# Altium project Shield_MCXC444.PrjPcb
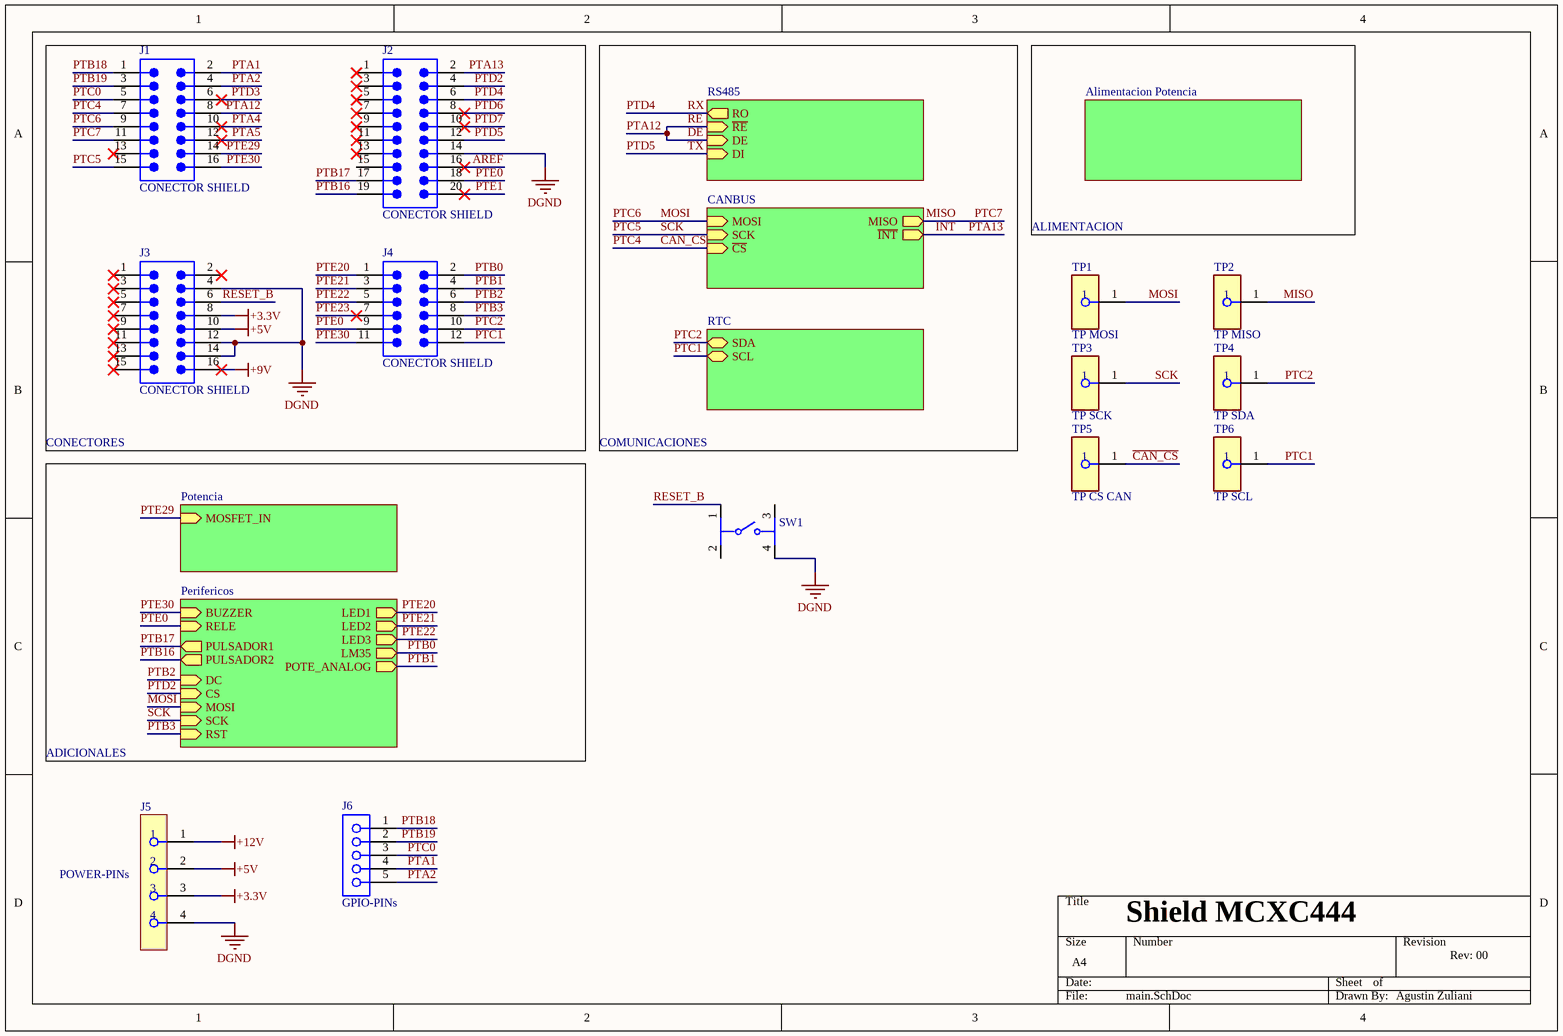
[diagram p0: main.SchDoc]
Libreria-Altium: D:\Altium-Libraries-master\Altium-Libraries-master
6 sheets, 99 parts. Net scope: hierarchical (ports join the sheet entries above them; power ports are global).
Board file: Shield_MCXC444 - PCB.PcbDoc
Sheets:
  main.SchDoc
    RS485 = RS485.SchDoc
    CANBUS = CANBUS.SchDoc
    Potencia = Potencia.SchDoc
    Perifericos = Perifericos.SchDoc
    RTC = RTC.SchDoc

## Sheet main.SchDoc: Shield MCXC444
size A4; Author: Agustin Zuliani; CompanyName: Depto. de Sistemas e Informática (DSI); DrawnBy: Agustin Zuliani; Revision: Rev: 00; SheetNumber: 1; SheetTotal: 7

### Parts
J1  CONECTOR SHIELD  [61301621121]
J2  CONECTOR SHIELD  [61302021121]
J3  CONECTOR SHIELD  [61301621121]
J4  CONECTOR SHIELD  [61301221121]
J5  POWER-PINs  [FP-ESW-104-23-G-S-MFG]
J6  GPIO-PINs  [SMTC-SMH-105-02-X-S]
SW1  PULSADOR RESET  [FP-1-1825910-4-MFG]  (value not drawn)
TP1  TP MOSI  [FP-5004-MFG]
TP2  TP MISO  [FP-5004-MFG]
TP3  TP SCK  [FP-5004-MFG]
TP4  TP SDA  [FP-5004-MFG]
TP5  TP CS CAN  [FP-5004-MFG]
TP6  TP SCL  [FP-5004-MFG]

### Blocks framed on the sheet
CONECTORES: J1-J4

### Sub-sheets
Alimentacion Potencia = Alimentacion Potencia.SchDoc (file not in this document): no entries
CANBUS = CANBUS.SchDoc: MOSI (in), MISO (out), SCK (in), ~{CS} (in), ~{INT} (out)
Perifericos = Perifericos.SchDoc: LED1 (out), LED2 (out), LED3 (out), BUZZER (in), RELE (in), PULSADOR1 (out), PULSADOR2 (out), LM35 (out), POTE_ANALOG (out), DC (in), CS (in), MOSI (in), SCK (in), RST (in)
Potencia = Potencia.SchDoc: MOSFET_IN (in)
RS485 = RS485.SchDoc: ~{RE} (in), DE (in), DI (in), RO (out)
RTC = RTC.SchDoc: SDA (bidir), SCL (bidir)

### Nets
+3.3V: J3.8 J5.3
+5V: J3.10 J5.2
+9V: J3.16
+12V: J5.1
DGND: J2.14 J3.4 J3.12 J3.14 J5.4 SW1.4
~{CAN_CS}: J1.7 TP5.1 ; sheet CANBUS/~{CS}  [also labelled PTC4]
~{INT}: J2.2 ; sheet CANBUS/~{INT}  [also labelled PTA13]
~{RE}: J1.8 ; sheet RS485/~{RE}, sheet RS485/DE  [also labelled DE, PTA12]
AREF: J2.16
MISO: J1.11 TP2.1 ; sheet CANBUS/MISO  [also labelled PTC7]
MOSI: J1.9 TP1.1 ; sheet CANBUS/MOSI, sheet Perifericos/MOSI  [also labelled PTC6]
PTA1: J1.2 J6.4
PTA2: J1.4 J6.5
PTA4: J1.10
PTA5: J1.12
PTB0: J4.2 ; sheet Perifericos/LM35
PTB1: J4.4 ; sheet Perifericos/POTE_ANALOG
PTB2: J4.6 ; sheet Perifericos/DC
PTB3: J4.8 ; sheet Perifericos/RST
PTB16: J2.19 ; sheet Perifericos/PULSADOR2
PTB17: J2.17 ; sheet Perifericos/PULSADOR1
PTB18: J1.1 J6.1
PTB19: J1.3 J6.2
PTC0: J1.5 J6.3
PTC1: J4.12 TP6.1 ; sheet RTC/SCL
PTC2: J4.10 TP4.1 ; sheet RTC/SDA
PTC5: J1.15 TP3.1 ; sheet CANBUS/SCK, sheet Perifericos/SCK  [also labelled SCK]
PTD2: J2.4 ; sheet Perifericos/CS
PTD3: J1.6
PTD4: J2.6 ; sheet RS485/RO  [also labelled RX]
PTD5: J2.12 ; sheet RS485/DI  [also labelled TX]
PTD6: J2.8
PTD7: J2.10
PTE0: J2.18 J4.9 ; sheet Perifericos/RELE
PTE1: J2.20
PTE20: J4.1 ; sheet Perifericos/LED1
PTE21: J4.3 ; sheet Perifericos/LED2
PTE22: J4.5 ; sheet Perifericos/LED3
PTE23: J4.7
PTE29: J1.14 ; sheet Potencia/MOSFET_IN
PTE30: J1.16 J4.11 ; sheet Perifericos/BUZZER
RESET_B: J3.6 SW1.1

Not connected (* = marked no-connect by the designer): J1 13*; J2 1* 3* 5* 7* 9* 11* 13* 15; J3 1* 2* 3* 5* 7* 9* 11* 13* 15*; SW1 2 3

### Notes on the sheet
- ALIMENTACION
- COMUNICACIONES
- ADICIONALES

### Library data of the parts
J1 J3 = CMP-1502-01097-3: HEADER PINS 16 POS 2.54mm / Conexion shield; NexarPartId: 32855550; Contact Resistance: 20mΩ; Operating Supply Voltage: 250V; Number of Contacts: 16; Current Rating: 3A; Connector Type: Male Pin; Gender: Male; Min Operating Temperature: -40°C; Contact Material: Copper; RoHS: Compliant; Lead Pitch: 2.54mm; Color: Black; Contact Mating Length: 5.9944mm; REACH SVHC: Unknown; Number of Rows: 2; Orientation: Vertical; Number of Positions: 16; Max Operating Temperature: 105°C; Termination: Solder; Packaging: Bulk; Height: 8.89mm; Mount: Through Hole; Contact Plating: Gold; Row Spacing: 2.54mm; Voltage Rating: 250V; Number of Pins: 16; Pitch: 2.54mm
J2 = CMP-1502-01104-3: HEADER PINS 20 POS 2.54mm / Conexion shield; NexarPartId: 32855556; Current Rating: 3A; Operating Supply Voltage: 250V; Contact Resistance: 20mΩ; Gender: Male; Number of Positions: 20; Connector Type: Male Pin; Contact Material: Copper; Number of Rows: 2; Lead Pitch: 2.54mm; Packaging: Bulk; Mount: Through Hole; Number of Pins: 20; Row Spacing: 2.54mm; Contact Mating Length: 5.9944mm; Number of Contacts: 20; Pitch: 2.54mm; Color: Black; Contact Plating: Gold; Orientation: Vertical; Termination: Solder; REACH SVHC: Unknown; RoHS: Compliant
J4 = CMP-1502-01088-4: HEADER PINS 12 POS 2.54mm / Conexion shield; NexarPartId: 32855540; Gender: Male; Number of Contacts: 12; Contact Resistance: 20mΩ; Connector Type: Male Pin; Current Rating: 3A; Operating Supply Voltage: 250V; Termination: Solder; Contact Plating: Gold; Height: 8.89mm; Color: Black; Row Spacing: 2.54mm; Contact Mating Length: 5.9944mm; REACH SVHC: Unknown; Mount: Through Hole; Orientation: Vertical; Number of Rows: 2; Packaging: Bulk; Number of Pins: 12; Number of Positions: 12; Contact Material: Copper; Lead Pitch: 2.54mm; Min Operating Temperature: -40°C; Voltage Rating: 250V; RoHS: Compliant; Pitch: 2.54mm; Max Operating Temperature: 105°C
J5 = CMP-00575-09268283-1: HEADER PINS 4 POS 2.54mm / Power Pins; Manufacturer Lifecycle Status: PRODUCTION; Contact Resistance: 10mΩ; Max Voltage Rating (AC): 550V; Current Rating: 5.2A; Max Current Rating: 6.9A; Number of Contacts: 4; Length: 10.67mm; Termination: Solder; Contact Material: Gold, Nickel; Orientation: Straight; Housing Material: Polyester; Max Operating Temperature: 125°C; Depth: 2.41mm; RoHS: Compliant; Housing Color: Black; Min Operating Temperature: -55°C; Number of Rows: 1; Height: 13.72mm; Radiation Hardening: No; Lifecycle Status: Production; Pitch: 2.54mm; Contact Plating: Gold
J6 = CMP-1023-00168-1: HEADER PINS 5 POS / Gpios Pins; PartNumber: SMH-105-02-G-S; Manufacturer: Samtec; Pitch: 2.54 mm; ComponentLink2Description: Datasheet; RoHS: True; ComponentLink2URL: http://www.samtec.com/documents/webfiles/pdf/SMH.PDF; ComponentLink1URL: http://www.samtec.com; DatasheetVersion: F-214; PackageReference: SMH-105-02-X-S; ComponentLink3URL: http://www.samtec.com/documents/webfiles/cpdf/SMH-1XX-XX-XX-X-XX-MKT.pdf; PackageDescription: .100 [2.54] Horizontal SMT Socket Assembly; Mounting Technology: Surface Mount; PackageVersion: AF, 2/1999; ComponentLink3Description: Package Specification; Temperature Range: -55 to 125 degC; Orientation: Horizontal; ComponentLink1Description: Manufacturer URL
SW1 = CMP-03407-000002-1: SWITCH TACTILE 6mm / RESET; Manufacturer: TE Connectivity; Manufacturer Part Number: 1-1825910-4; Throw Configuration: SPST-NO; Operating Force: 160gf; Contact Current Rating: 50mA; Voltage Rating Dc: 24V; Electromechanical Life: 100000Cycles; Contact Resistance: 100mΩ; Octopart: https://octopart.com/1-1825910-4-te+connectivity-42270468; ComponentLink2URL: https://www.te.com/commerce/DocumentDelivery/DDEController?Action=showdoc&DocId=Customer+Drawing%7F1825910%7FC10%7Fpdf%7FEnglish%7FENG_CD_1825910_C10.pdf%7F1-1825910-4; Height: 9.8mm; Package: 1-1825910-4; Automotive: No; Device Class L2: Switches; Temperature Range High: +85°C; Device Class L3: Tactile Switches; Mouser Description: Tactile Switches 6MM ACTHIGH TEMP TACT SWITCH; Lead Free: Yes; Temperature Range Low: -35°C; Digikey Description: SWITCH TACTILE SPST-NO 0.05A 24V; Device Class L1: Electromechanical; Mount: Through Hole; RoHS: TRUE; ComponentLink2Description: Datasheet; Temperature: -35°C to +85°C; Category: Switch
TP1-TP6 = CMP-2000-05575-2: PC TEST POINT MINIATURE YELLOW; Manufacturer: Keystone; Manufacturer Part Number: 5004; Number Of Contacts: 1; Is Female: yes; Device Class L1: Connectors; Digikey Description: PC TEST POINT MINIATURE YELLOW; ComponentLink2URL: https://www.keyelco.com/product-pdf.cfm?p=1313; Lead Free: Yes; ComponentLink2Description: Datasheet; Category: Conn; Height: 4.72mm; Octopart: https://octopart.com/5004-keystone-28591; Mouser Description: TEST POINT PC MINI .040"D YELLOW; Device Class L3: unset; Contact Material: Silver; Package: 5004; Automotive: No; Device Class L2: unset; RoHS: TRUE

## Sheet RS485.SchDoc: Comunicación RS-485
size A4; Author: Agustin Zuliani; Revision: Rev: 00; SheetNumber: 2; SheetTotal: 7
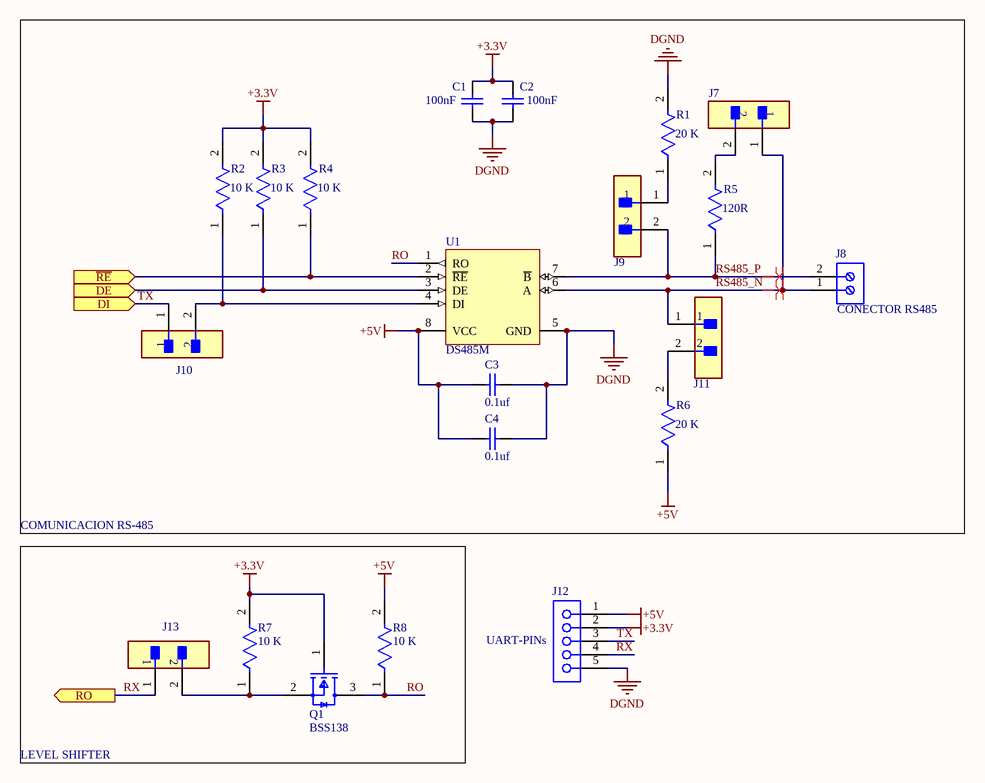
[diagram p1: RS485.SchDoc]

### Parts
C1  100nF  [CAPC2013X145X50LL20T25]
C2  100nF  [CAPC2013X145X50LL20T25]
C3  0.1uf  [CAPC2013X145X50NL20T25]
C4  0.1uf  [CAPC2013X145X50NL20T25]
J7  TSW-102-07-F-S  [FP-TSW-102-07-F-S-MFG]  (value not drawn)
J8  CONECTOR RS485  [691102710002]
J9  TSW-102-07-F-S  [FP-TSW-102-07-F-S-MFG]  (value not drawn)
J10  TSW-102-07-F-S  [FP-TSW-102-07-F-S-MFG]  (value not drawn)
J11  TSW-102-07-F-S  [FP-TSW-102-07-F-S-MFG]  (value not drawn)
J12  UART-PINs  [SMTC-ESQ-105-12-X-S]
J13  TSW-102-07-F-S  [FP-TSW-102-07-F-S-MFG]  (value not drawn)
Q1  BSS138  [FP-318-08-IPC_B]
R1  20 K  [FP-RN73R2A-IPC_A]
R2  10 K  [FP-RN73R2A-IPC_A]
R3  10 K  [FP-RN73R2A-IPC_A]
R4  10 K  [FP-RN73R2A-IPC_A]
R5  120R  [FP-RN73R2A-IPC_A]
R6  20 K  [FP-RN73R2A-IPC_A]
R7  10 K  [FP-AC0805-MFG]
R8  10 K  [FP-AC0805-MFG]
U1  DS485M  [D0008A_N]

### Blocks framed on the sheet
COMUNICACION RS-485: C1-C4 J7-J11 R1-R6 U1

### Ports
DE (in), DI (in), RO (out), ~{RE} (in)

### Nets
+3.3V: C1.1 C2.1 J12.2 Q1.1(G) R2.2 R3.2 R4.2 R7.2
+5V: C3.2 C4.2 J12.1 R6.1 R8.2 U1.8(VCC)
DGND: C1.2 C2.2 C3.1 C4.1 J12.5 R1.2 U1.5(GND)
~{RE}: R3.1 R4.1 U1.2(~{RE}) U1.3(DE) ; port ~{RE}, port DE
RO: Q1.3(D) R8.1 U1.1(RO)
RS485_N: J7.1 J8.1 J11.1 U1.6(A)
RS485_P: J8.2 J9.2 R5.1 U1.7(~{B})
RX: J12.4 J13.1 ; port RO  [project net PTD4]
TX: J10.1 J12.3 ; port DI  [project net PTD5]
NetJ7_2: J7.2 R5.2
NetJ9_1: J9.1 R1.1
NetJ10_2: J10.2 R2.1 U1.4(DI)
NetJ11_2: J11.2 R6.2
NetJ13_2: J13.2 Q1.2(S) R7.1

### Layout directives
differential pair: RS485_N, RS485_P

### Notes on the sheet
- LEVEL SHIFTER

### Library data of the parts
C1 C2 = CMP-2007-01107-1: CAP 100nf 20% 0805; Manufacturer: Kemet; Part Number: C0805X104K3RACTU
C3 C4 = CMP-2007-01227-1: CAP 100nf 20% 0805; Manufacturer: Kemet; Part Number: C0805S104K5RACTU
J7 = CMP-02766-001458-1: HEADER 2 POS 2.54mm; Gender: Male; Max Current Rating: 7.6A; Number of Contacts: 2; Max Voltage Rating (AC): 550V; Orientation: Straight; Depth: 2.54mm; Series: TSW; Package Quantity: 1; Min Operating Temperature: -55°C; Max Operating Temperature: 125°C; Contact Type: Male Pin; Contact Shape: Square; Color: Black; Housing Color: Black; Connector Type: Header; Fastening Type: Pull; Radiation Hardening: No; Pitch: 2.54mm; Housing Material: Polyester; Mount: Through Hole; Number of Positions: 2; Number of Rows: 1; Contact Material: Bronze; Insulation Color: Black; Contact Finish - Mating: GOLD; Termination: Solder; Insulation Material: PBT; Length: 5.08mm; Flammability Rating: UL94 V-0; Contact Mating Length: 0.23inch; REACH SVHC: No SVHC; Contact Plating: Gold; RoHS Compliant: Yes; Packaging: Bulk
J8 = CMP-1502-03258-2: NexarPartId: 8917706; Number of Levels: 1; Number of Positions Per Level: 2; Current: 15A; Voltage: 300V; Pitch: 5.0038mm; Plating: Steel; Stripping Length: -6mm; Wire Gauge (Min): 14AWG; Wire Gauge (Max): 22AWG; Length: 7.5mm; Contact Material: Brass; Contact Plating: Tin; Packaging: Box; Number of Pins: 2; Voltage Rating: 300V; Termination: Screw; Number of Contacts: 2; Color: Blue; Current Rating: 15A; Mount: Through Hole; Max Operating Temperature: 105°C; Min Operating Temperature: -40°C; REACH SVHC: Unknown; Height: 13.4mm; Width: 11.2mm; Housing Material: Nylon; RoHS: Compliant; Wire/Cable Gauge: 22AWG; Lead Pitch: 5mm
J9 J11 = CMP-02766-001458-1: HEADER 2 POS 2.54mm / Habilitacion RES 20K; Gender: Male; Max Current Rating: 7.6A; Number of Contacts: 2; Max Voltage Rating (AC): 550V; Orientation: Straight; Depth: 2.54mm; Series: TSW; Package Quantity: 1; Min Operating Temperature: -55°C; Max Operating Temperature: 125°C; Contact Type: Male Pin; Contact Shape: Square; Color: Black; Housing Color: Black; Connector Type: Header; Fastening Type: Pull; Radiation Hardening: No; Pitch: 2.54mm; Housing Material: Polyester; Mount: Through Hole; Number of Positions: 2; Number of Rows: 1; Contact Material: Bronze; Insulation Color: Black; Contact Finish - Mating: GOLD; Termination: Solder; Insulation Material: PBT; Length: 5.08mm; Flammability Rating: UL94 V-0; Contact Mating Length: 0.23inch; REACH SVHC: No SVHC; Contact Plating: Gold; RoHS Compliant: Yes; Packaging: Bulk
J10 = CMP-02766-001458-1: HEADER 2 POS 2.54mm / Habilitacion TX; Gender: Male; Max Current Rating: 7.6A; Number of Contacts: 2; Max Voltage Rating (AC): 550V; Orientation: Straight; Depth: 2.54mm; Series: TSW; Package Quantity: 1; Min Operating Temperature: -55°C; Max Operating Temperature: 125°C; Contact Type: Male Pin; Contact Shape: Square; Color: Black; Housing Color: Black; Connector Type: Header; Fastening Type: Pull; Radiation Hardening: No; Pitch: 2.54mm; Housing Material: Polyester; Mount: Through Hole; Number of Positions: 2; Number of Rows: 1; Contact Material: Bronze; Insulation Color: Black; Contact Finish - Mating: GOLD; Termination: Solder; Insulation Material: PBT; Length: 5.08mm; Flammability Rating: UL94 V-0; Contact Mating Length: 0.23inch; REACH SVHC: No SVHC; Contact Plating: Gold; RoHS Compliant: Yes; Packaging: Bulk
J12 = CMP-1026-00012-1: HEADER PINS 5 WAY / Pines UART; Manufacturer: Samtec; PartNumber: ESQ-105-12-L-S; Pitch: 2.54 mm; PackageDescription: ESQ Strip ASM; Mounting Technology: Through-hole; DatasheetVersion: F-214; ComponentLink1URL: http://www.samtec.com; RoHS: True; ComponentLink3Description: Package Specification; ComponentLink2URL: http://www.samtec.com/documents/webfiles/pdf/ESQ_TH.PDF; ComponentLink3URL: http://www.samtec.com/documents/webfiles/cpdf/ESQ-1XX-XX-X-X-XXX-XX-X-XX-MKT.pdf; ComponentLink2Description: Datasheet; PackageVersion: BZ, 9/1998; Temperature Range: -55 to 125 degC; Orientation: Vertical; PackageReference: ESQ-105-12-X-S; ComponentLink1Description: Manufacturer URL
J13 = CMP-02766-001458-1: HEADER 2 POS 2.54mm / Habilitacion RX; Gender: Male; Max Current Rating: 7.6A; Number of Contacts: 2; Max Voltage Rating (AC): 550V; Orientation: Straight; Depth: 2.54mm; Series: TSW; Package Quantity: 1; Min Operating Temperature: -55°C; Max Operating Temperature: 125°C; Contact Type: Male Pin; Contact Shape: Square; Color: Black; Housing Color: Black; Connector Type: Header; Fastening Type: Pull; Radiation Hardening: No; Pitch: 2.54mm; Housing Material: Polyester; Mount: Through Hole; Number of Positions: 2; Number of Rows: 1; Contact Material: Bronze; Insulation Color: Black; Contact Finish - Mating: GOLD; Termination: Solder; Insulation Material: PBT; Length: 5.08mm; Flammability Rating: UL94 V-0; Contact Mating Length: 0.23inch; REACH SVHC: No SVHC; Contact Plating: Gold; RoHS Compliant: Yes; Packaging: Bulk
Q1 = CMP-07173-000101-1: MOSFET BSS138 SOT-23 / Level shifter RX; Turn-Off Delay Time: 20ns; Drain to Source Breakdown Voltage: 50V; Element Configuration: Single; Current Rating: 220mA; Rds On Max: 3.5R; Gate to Source Voltage (Vgs): 20V; Threshold Voltage: 1.3V; Number of Elements: 1; Power Dissipation: 360mW; Rise Time: 9ns; Turn-On Delay Time: 2.5ns; Input Capacitance: 27pF; On-State Resistance: 6R; Lead Free: Lead Free; Length: 2.92mm; Width: 1.3mm; Min Operating Temperature: -55°C; REACH SVHC: No SVHC; Packaging: Tape and Reel; Radiation Hardening: No; Height: 0.93mm; Drain to Source Voltage (Vdss): 50V; Voltage Rating (DC): 50V; Weight: 0.03g; Continuous Drain Current (ID): 220mA; Number of Pins: 3; Nominal Vgs: 1.3V; Max Power Dissipation: 360mW; Fall Time: 9ns; Drain to Source Resistance: 3.5R; Contact Plating: Tin; Case/Package: SOT-23; Package Quantity: 1; Dual Supply Voltage: 50V; Mount: Surface Mount; Termination: SMD/SMT; Max Operating Temperature: 150°C
R1 R6 = CMP-04015-052084-1: RES 20K 5% 0805
R2-R4 = CMP-04015-052084-1: RES 10K 5% 0805
R5 = CMP-04015-052084-1: RES 120R 5% 0805 / Resistencia de terminacion
R7 R8 = CMP-2001-04494-2: RES 10K 5% 0805; Manufacturer Part Number: AC0805FR-072K2L; Manufacturer: Yageo; Value: 2.2KΩ; Automotive Grade: Grade 0; Voltage Rating: 150V; Tolerance: 0.01; Power Rating: 1/8W; Series: AC; Category: Res; Device Class L1: Passive Components; Digikey Description: RES SMD 2.2K OHM 1% 1/8W 0805; Mouser Description: Thick Film Resistors - SMD 1/8W 2.2K ohm 1% AEC-Q200; ComponentLink2Description: Datasheet; Composition: Thick Film; Height: 0.6mm; Temperature Range High: +155°C; Temperature Range Low: -55°C; Package: AC0805; Temperature: -55°C to +155°C; RoHS: TRUE; Ipc Land Pattern Name: RESC200125X50; Footprint Url: http://www.yageo.com/exep/pages/download/literatures/PYu-R_Mount_10.pdf; ComponentLink2URL: http://www.yageo.com/documents/recent/PYu-AC_51_RoHS_L_6.pdf; Resistance: 2.2KΩ; Automotive: Yes; Device Class L2: Resistors; Device Class L3: Chip SMD Resistors; Octopart: https://octopart.com/ac0805fr-072k2l-yageo-26041153; Lead Free: Yes
U1 = CMP-0058-00811-3: CI MAX485; Manufacturer: Texas Instruments; PackageTopMarking: NSZXTT*DS485*M; CompType: Interface IC; PowerWise: N; ComponentLink1URL: http://www.ti.com/general/docs/lit/getliterature.tsp?genericPartNumber=DS485&fileType=pdf; PackageReference: D0008A; ComponentLink1Description: Datasheet URL; Code_IPC: SOIC127P600-8; PinCount: 8; Code_JEDEC: MS-012-AA; RoHS: N; PackageDescription: SOIC Narrow, 4.9 x 3.9 x 1.45mm, 8 Lead, 1.27mm Pitch

## Sheet CANBUS.SchDoc: Comunicación CAN BUS
size A4; Author: Agustin Zuliani; Revision: Rev: 00; SheetNumber: 3; SheetTotal: 7
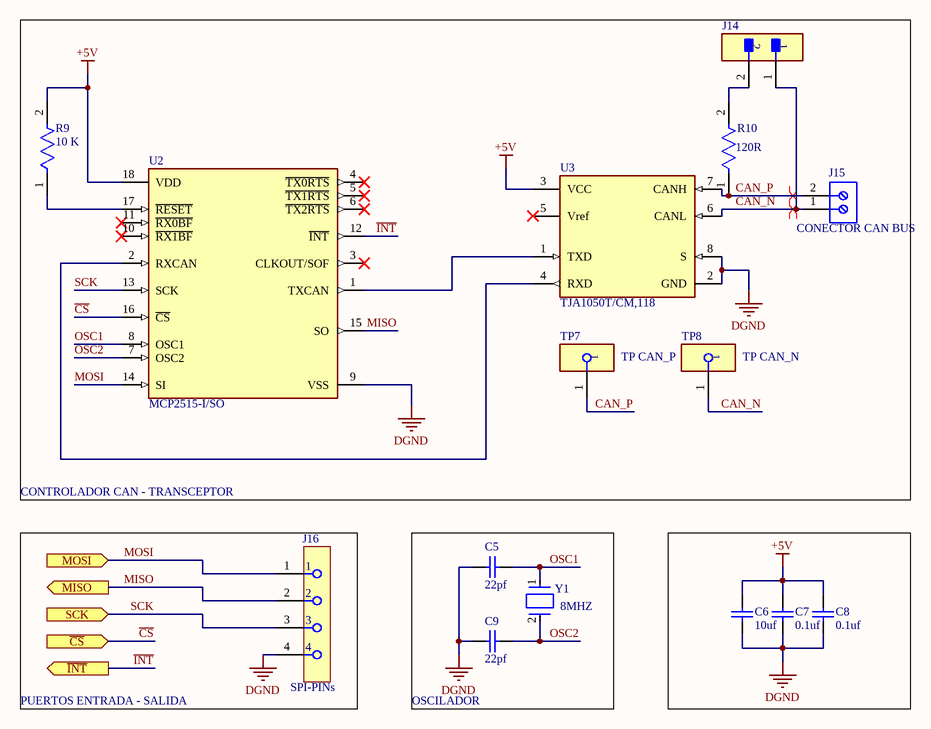
[diagram p2: CANBUS.SchDoc]

### Parts
C5  22pf  [CAPC2013X145X50NL20T25]
C6  10uf  [CAPC2013X145X50NL20T25]
C7  0.1uf  [CAPC2013X145X50NL20T25]
C8  0.1uf  [CAPC2013X145X50NL20T25]
C9  22pf  [CAPC2013X145X50NL20T25]
J14  TSW-102-07-F-S  [FP-TSW-102-07-F-S-MFG]  (value not drawn)
J15  CONECTOR CAN BUS  [691102710002]
J16  SPI-PINs  [FP-ESW-104-23-G-S-MFG]
R9  10 K  [FP-AC0805-MFG]
R10  120R  [FP-RN73R2A-IPC_A]
TP7  TP CAN_P  [FP-5004-MFG]
TP8  TP CAN_N  [FP-5004-MFG]
U2  MCP2515-I/SO  [FP-C04-051-MFG]
U3  TJA1050T/CM,118  [FP-SOT96-1-IPC_A]
Y1  8MHZ  [FP-ECS-80-20-4X-MFG]

### Blocks framed on the sheet
CONTROLADOR CAN - TRANSCEPTOR: J14 J15 R9 R10 TP7 TP8 U2 U3
PUERTOS ENTRADA - SALIDA: J16
OSCILADOR: C5 C9 Y1

### Ports
MISO (out), MOSI (in), SCK (in), ~{CS} (in), ~{INT} (out)

### Nets
+5V: C6.2 C7.2 C8.2 R9.2 U2.18(VDD) U3.3(VCC)
DGND: C5.1 C6.1 C7.1 C8.1 C9.1 J16.4 U2.9(VSS) U3.2(GND) U3.8(S)
~{CS}: U2.16(~{CS}) ; port ~{CS}  [project net ~{CAN_CS}]
CAN_N: J14.1 J15.1 TP8.1 U3.6(CANL)
CAN_P: J15.2 R10.1 TP7.1 U3.7(CANH)
~{INT}: U2.12(~{INT}) ; port ~{INT}  [project net ~{INT}]
MISO: J16.2 U2.15(SO) ; port MISO
MOSI: J16.1 U2.14(SI) ; port MOSI
OSC1: C5.2 U2.8(OSC1) Y1.1
OSC2: C9.2 U2.7(OSC2) Y1.2
SCK: J16.3 U2.13(SCK) ; port SCK  [project net PTC5]
NetJ14_2: J14.2 R10.2
NetR9_1: R9.1 U2.17(~{RESET})
NetU2_1: U2.1(TXCAN) U3.1(TXD)
NetU2_2: U2.2(RXCAN) U3.4(RXD)

Not connected (* = marked no-connect by the designer): U2 3(CLKOUT/SOF)* 4(~{TX0RTS})* 5(~{TX1RTS})* 6(~{TX2RTS})* 10(~{RX1BF})* 11(~{RX0BF})*; U3 5(Vref)*

### Layout directives
differential pair: CAN_N, CAN_P

### Library data of the parts
C5 C9 = CMP-2007-01227-1: CAP 22pf 20% 0805; Manufacturer: Kemet; Part Number: C0805S104K5RACTU
C6 = CMP-2007-01227-1: CAP 10uf 20% 0805; Manufacturer: Kemet; Part Number: C0805S104K5RACTU
C7 C8 = CMP-2007-01227-1: as C3 on sheet RS485
J14 = CMP-02766-001458-1: HEADER PINS 2 POS / Jumper de Res. Terminacion; Gender: Male; Max Current Rating: 7.6A; Number of Contacts: 2; Pitch: 2.54mm; Max Voltage Rating (AC): 550V; Orientation: Straight; Depth: 2.54mm; Series: TSW; Package Quantity: 1; Min Operating Temperature: -55°C; Max Operating Temperature: 125°C; Contact Type: Male Pin; Contact Shape: Square; Color: Black; Housing Color: Black; Connector Type: Header; Fastening Type: Pull; Radiation Hardening: No; Housing Material: Polyester; Mount: Through Hole; Number of Positions: 2; Number of Rows: 1; Contact Material: Bronze; Insulation Color: Black; Contact Finish - Mating: GOLD; Termination: Solder; Insulation Material: PBT; Length: 5.08mm; Flammability Rating: UL94 V-0; Contact Mating Length: 0.23inch; REACH SVHC: No SVHC; Contact Plating: Gold; RoHS Compliant: Yes; Packaging: Bulk
J15 = CMP-1502-03258-2: TERMINAL BLOCK 2 POS / Salida BUS CAN; NexarPartId: 8917706; Number of Levels: 1; Number of Positions Per Level: 2; Current: 15A; Voltage: 300V; Pitch: 5.0038mm; Plating: Steel; Stripping Length: -6mm; Wire Gauge (Min): 14AWG; Wire Gauge (Max): 22AWG; Length: 7.5mm; Contact Material: Brass; Contact Plating: Tin; Packaging: Box; Number of Pins: 2; Voltage Rating: 300V; Termination: Screw; Number of Contacts: 2; Color: Blue; Current Rating: 15A; Mount: Through Hole; Max Operating Temperature: 105°C; Min Operating Temperature: -40°C; REACH SVHC: Unknown; Height: 13.4mm; Width: 11.2mm; Housing Material: Nylon; RoHS: Compliant; Wire/Cable Gauge: 22AWG; Lead Pitch: 5mm
J16 = CMP-00575-09268283-1: HEADER PINS 4 POS / SPI Pins; Manufacturer Lifecycle Status: PRODUCTION; Contact Resistance: 10mΩ; Max Voltage Rating (AC): 550V; Current Rating: 5.2A; Max Current Rating: 6.9A; Number of Contacts: 4; Pitch: 2.54mm; Length: 10.67mm; Termination: Solder; Contact Material: Gold, Nickel; Orientation: Straight; Housing Material: Polyester; Max Operating Temperature: 125°C; Depth: 2.41mm; RoHS: Compliant; Housing Color: Black; Min Operating Temperature: -55°C; Number of Rows: 1; Height: 13.72mm; Radiation Hardening: No; Lifecycle Status: Production; Contact Plating: Gold
R9 = CMP-2001-04494-2: as R7 on sheet RS485; Series: AC; Category: Res; Device Class L1: Passive Components; Digikey Description: RES SMD 2.2K OHM 1% 1/8W 0805; Mouser Description: Thick Film Resistors - SMD 1/8W 2.2K ohm 1% AEC-Q200; ComponentLink2Description: Datasheet; Composition: Thick Film; Height: 0.6mm; Temperature Range High: +155°C; Temperature Range Low: -55°C; Package: AC0805; Temperature: -55°C to +155°C; RoHS: TRUE; Ipc Land Pattern Name: RESC200125X50; Footprint Url: http://www.yageo.com/exep/pages/download/literatures/PYu-R_Mount_10.pdf; ComponentLink2URL: http://www.yageo.com/documents/recent/PYu-AC_51_RoHS_L_6.pdf; Resistance: 2.2KΩ; Automotive: Yes; Device Class L2: Resistors; Device Class L3: Chip SMD Resistors; Octopart: https://octopart.com/ac0805fr-072k2l-yageo-26041153; Lead Free: Yes
R10 = CMP-04015-052084-1: as R5 on sheet RS485
TP7 TP8 = CMP-2000-05575-2: as TP1 on sheet main; Device Class L1: Connectors; Digikey Description: PC TEST POINT MINIATURE YELLOW; ComponentLink2URL: https://www.keyelco.com/product-pdf.cfm?p=1313; Lead Free: Yes; ComponentLink2Description: Datasheet; Category: Conn; Height: 4.72mm; Octopart: https://octopart.com/5004-keystone-28591; Mouser Description: TEST POINT PC MINI .040"D YELLOW; Device Class L3: unset; Contact Material: Silver; Package: 5004; Automotive: No; Device Class L2: unset; RoHS: TRUE
U2 = CMP-0186-00133-3: CI MCP2515 SOIC18; Manufacturer: Microchip; Min Supply Voltage: 2.7V; Function: Controller; Max Supply Voltage: 5.5V; Standoff Height: 0.1mm; Nominal Supply Current: 10mA; Interface: SPI,CAN; Lead Free: Yes; Digikey Description: IC CAN CONTROLLER W/SPI 18SOIC; Category: IC; RoHS: TRUE; Manufacturer Part Number: MCP2515-I/SO; ComponentLink2URL: http://ww1.microchip.com/downloads/en/DeviceDoc/MCP2515-Stand-Alone-CAN-Controller-with-SPI-20001801J.pdf; Mouser Description: CAN Interface IC W/ SPI Interface; Device Class L2: Interface ICs; Package: C04-051; Automotive: No; Octopart: https://octopart.com/mcp2515-i%2Fso-microchip-430187; Temperature: -40°C to +85°C; Ipc Land Pattern Name: SOIC127P1030X265-18; Ambient Temperature Range Low: -65°C; Height: 2.65mm; Device Class L1: Integrated Circuits (ICs); Ambient Temperature Range High: +125°C; Footprint Url: http://ww1.microchip.com/downloads/en/DeviceDoc/18L_SOIC_Wide_7.50_SO_C04-0051D.pdf; Temperature Range Low: -40°C; Device Class L3: Controllers; Temperature Range High: +85°C; ComponentLink2Description: Datasheet
U3 = CMP-2000-04923-2: CI TJA1050 TRANSCEIVER SOIC8; Simplex/Duplex: Half Duplex; Max Supply Current: 10mA; Number of Receive Buffers: 1; Min Supply Voltage: 4.75V; Max Supply Voltage: 5.25V; Interface: CAN; Data Rate: 1Mbps; Receiver Hysteresis: 70mV; Number of Transmit Buffers: 1; Min Operating Temperature: -40°C; Case/Package: SO; REACH SVHC: No SVHC; Max Operating Temperature: 150°C; Number of Pins: 8; Lead Free: Lead Free; Number of Transceivers: 1; Packaging: Tape and Reel; Mount: Surface Mount; Radiation Hardening: No; Nominal Supply Current: 10mA; Package Quantity: 2500; Contact Plating: Gold
Y1 = CMP-1669-00002-3: CRYSTAL 8 MHz / CAN BUS; NexarPartId: 316504; Frequency Stability: 50ppm; ESR (Equivalent Series Resistance): 80Ω; Tolerance: 0.003%; Load Capacitance: 20pF; Schedule B: 8541600025, 8541600025; Number of Pins: 49; Max Operating Temperature: 70°C; Lead Free: Lead Free; Height: 3.5mm; Termination: Radial; Frequency: 8MHz; RoHS: Compliant; Frequency Tolerance: 0.003%; Packaging: Bulk; Mount: Through Hole; Width: 4.65mm; Length: 11.3538mm; Min Operating Temperature: -10°C

## Sheet Potencia.SchDoc: Circuito de Potencia
size A4; Author: Agustin Zuliani; Revision: Rev: 00; SheetNumber: 5; SheetTotal: 7
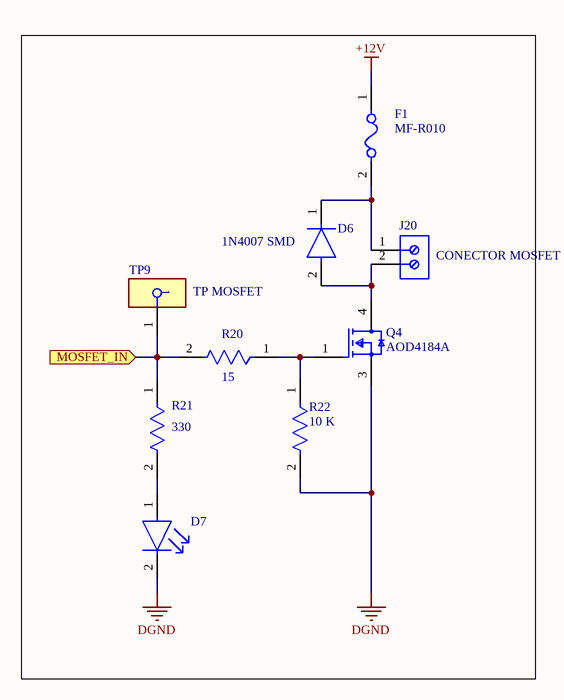
[diagram p3: Potencia.SchDoc]

### Parts
D6  1N4007 SMD  [FP-1N4007_SMD-IPC_C]
D7  SM0805YCL  [FP-SM0805YCL-MFG]  (value not drawn)
F1  MF-R010  [FP-MF-R010-MFG]
J20  CONECTOR MOSFET  [691102710002]
Q4  AOD4184A  [FP-TO252-MFG]
R20  15  [FP-RN73R2A-IPC_A]
R21  330  [FP-RN73R2A-IPC_A]
R22  10 K  [FP-RN73R2A-IPC_A]
TP9  TP MOSFET  [FP-5004-MFG]

### Ports
MOSFET_IN (in)

### Nets
+12V: F1.1
DGND: D7.2(C) Q4.3(S) R22.2
PTE29: R20.2 R21.1 TP9.1 ; port MOSFET_IN
NetD6_1: D6.1(C) F1.2 J20.1
NetD6_2: D6.2(A) J20.2 Q4.4(D)
NetD7_1: D7.1(A) R21.2
NetQ4_1: Q4.1(G) R20.1 R22.1

### Library data of the parts
D6 = CMP-12389-000001-1: DIODE 1N4148 THT / Proteccion Mosfet
D7 = CMP-35283-000007-1: LED SMD 0805 / Mosfet status; Luminous Intensity: 11.5mcd; Illumination Color: Yellow; Test Current: 2mA; Viewing Angle: 130°; Lens Transparency: Clear; Dominant Wavelength: 592nm; Forward Voltage: 1.9V; Lens Color: Colorless; Case Code (Metric): 2012; Length: 2mm; Max Operating Temperature: 80°C; Width: 1.2mm; Case Code (Imperial): 0805; Packaging: Tape and Reel; Mount: Surface Mount; Case/Package: 0805; Forward Current: 2mA; Height: 0.8mm; Lead Free: Lead Free; Min Operating Temperature: -30°C; Color: Yellow; Package Quantity: 4000
F1 = CMP-07400-000011-1: PTC RESET FUSE 60V 100MA RADIAL; Manufacturer: Bourns Inc.; Hold Current: 0.1A; Current Rating: 40A; Trip Current: 0.2A; Resistance: 2.5-7.5Ω; Trip Time: 4s; Value: 2.5-7.5Ω; Temperature Range High: +85°C; Mouser Description: Resettable Fuses - PPTC 60v Max 40Amps Max Hold .10 Trip .20; Manufacturer Part Number: MF-R010; Digikey Description: PTC RESET FUSE 60V 100MA RADIAL; Device Class L3: unset; Temperature Range Low: -40°C; Octopart: https://octopart.com/mf-r010-bourns-5791; Ambient Temperature Range Low: -40°C; Ambient Temperature Range High: +85°C; ComponentLink2Description: Datasheet; ComponentLink2URL: https://www.bourns.com/docs/Product-Datasheets/mfr.pdf; Automotive: No; Device Class L1: Circuit Protection; Device Class L2: PTC Resettable Fuses; Height: 12.7mm; Voltage Rating: 60V; RoHS: TRUE; Category: Fuse; Package: MF-R010; Lead Free: Yes; Temperature: -40°C to +85°C
J20 = CMP-1502-03258-2: TERMINAL BLOCK 2 POS / Salida Mosfet; NexarPartId: 8917706; Number of Levels: 1; Number of Positions Per Level: 2; Current: 15A; Voltage: 300V; Pitch: 5.0038mm; Plating: Steel; Stripping Length: -6mm; Wire Gauge (Min): 14AWG; Wire Gauge (Max): 22AWG; Length: 7.5mm; Contact Material: Brass; Contact Plating: Tin; Packaging: Box; Number of Pins: 2; Voltage Rating: 300V; Termination: Screw; Number of Contacts: 2; Color: Blue; Current Rating: 15A; Mount: Through Hole; Max Operating Temperature: 105°C; Min Operating Temperature: -40°C; REACH SVHC: Unknown; Height: 13.4mm; Width: 11.2mm; Housing Material: Nylon; RoHS: Compliant; Wire/Cable Gauge: 22AWG; Lead Pitch: 5mm
Q4 = CMP-83955-000007-1: MOSFET N AOD4148A TO252; Drain to Source Voltage (Vdss): 40V; Power Dissipation: 50W; Rds On Max: 7mR; Input Capacitance: 1.8nF; Gate to Source Voltage (Vgs): 20V; Continuous Drain Current (ID): 50A; Number of Elements: 1; Max Power Dissipation: 2.3W; Min Operating Temperature: -55°C; Max Operating Temperature: 175°C; Case/Package: DPAK; Mount: Surface Mount; Packaging: Cut Tape; Number of Pins: 3; Radiation Hardening: No
R20 = CMP-04015-052084-1: RES 15R 5% 0805
R21 = CMP-04015-052084-1: RES 330R 5% 0805
R22 = CMP-04015-052084-1: RES 10K 5% 0805
TP9 = CMP-2000-05575-2: as TP1 on sheet main; Device Class L1: Connectors; Digikey Description: PC TEST POINT MINIATURE YELLOW; ComponentLink2URL: https://www.keyelco.com/product-pdf.cfm?p=1313; Lead Free: Yes; ComponentLink2Description: Datasheet; Category: Conn; Height: 4.72mm; Octopart: https://octopart.com/5004-keystone-28591; Mouser Description: TEST POINT PC MINI .040"D YELLOW; Device Class L3: unset; Contact Material: Silver; Package: 5004; Automotive: No; Device Class L2: unset; RoHS: TRUE

## Sheet Perifericos.SchDoc: Perifericos
size A4; Author: Agustin Zuliani; Revision: Rev: 00; SheetNumber: 4; SheetTotal: 7
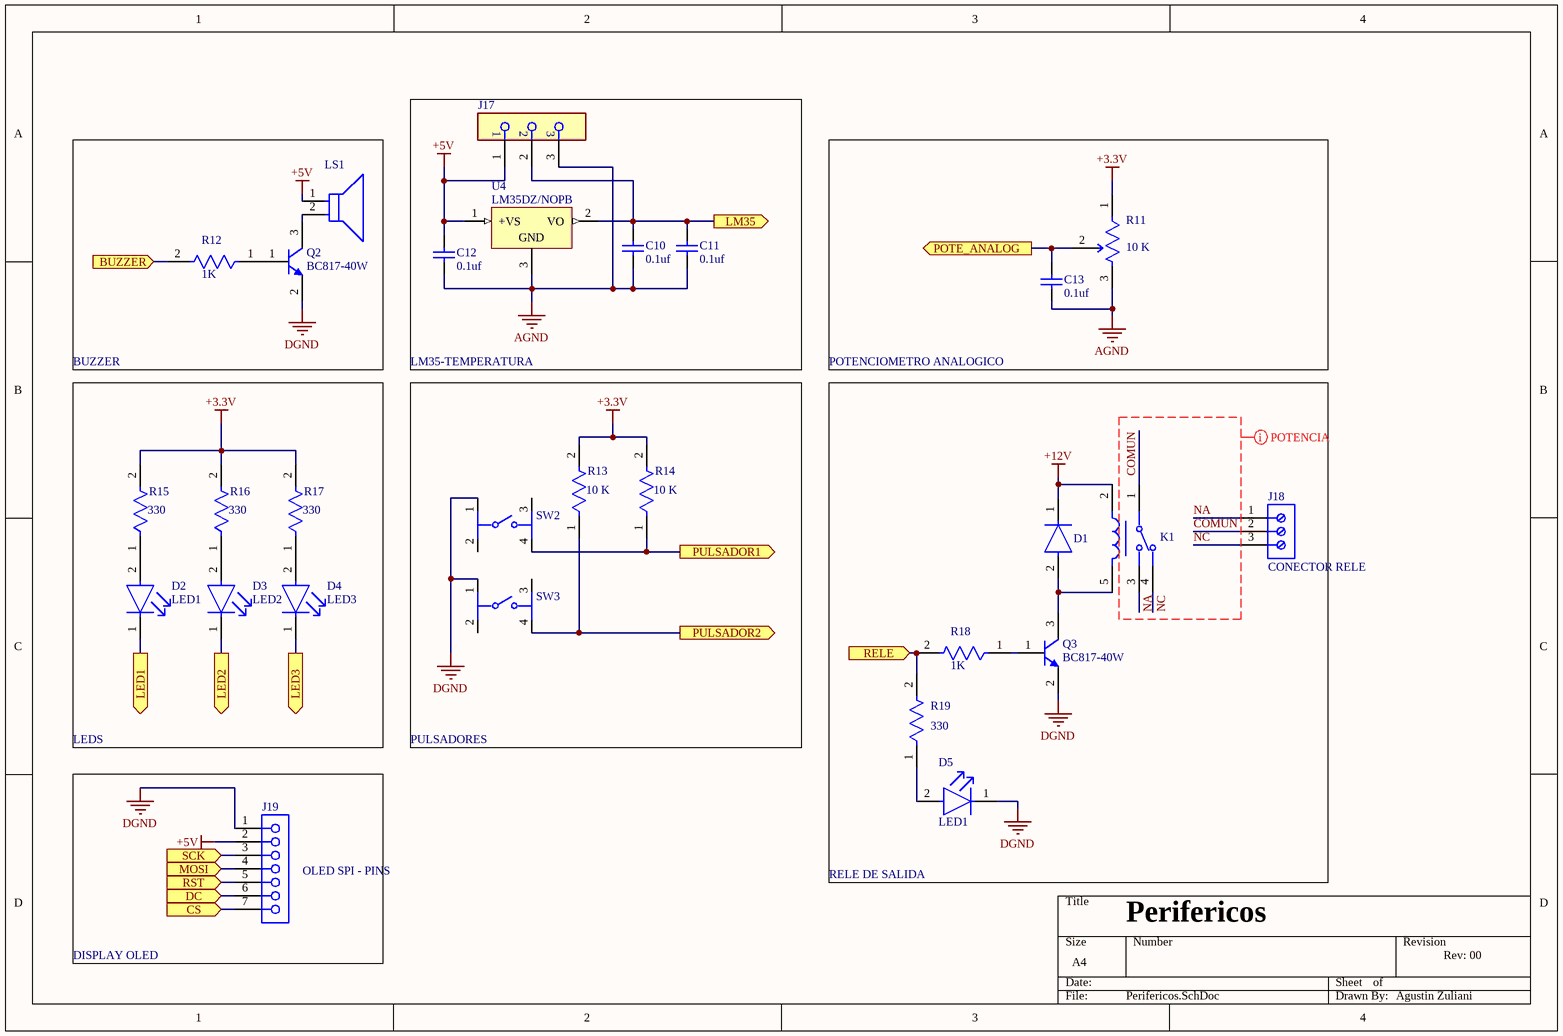
[diagram p4: Perifericos.SchDoc]

### Parts
C10  0.1uf  [CAPC2013X145X50NL20T25]
C11  0.1uf  [CAPC2013X145X50NL20T25]
C12  0.1uf  [CAPC2013X145X50NL20T25]
C13  0.1uf  [CAPC2013X145X50NL20T25]
D1  1N4007 SMD  [FP-1N4007_SMD-IPC_C]  (value not drawn)
D2  LED1  [FP-SML-LX0805UWC-TR-MFG]
D3  LED2  [FP-SML-LX0805UWC-TR-MFG]
D4  LED3  [FP-SML-LX0805UWC-TR-MFG]
D5  LED1  [FP-SML-LX0805UWC-TR-MFG]
J17  SSQ-103-01-T-S  [FP-SSQ-103-01-T-S-MFG]  (value not drawn)
J18  CONECTOR RELE  [691216710003]
J19  OLED SPI - PINS  [61300711821]
K1  G5LE-1-E DC5  [FP-G5LE-1-E_DC5-MFG]  (value not drawn)
LS1  AT-1224-TWT-5V-2-R  [FP-AT-1224-TWT-5V-2-R-MFG]  (value not drawn)
Q2  BC817-40W  [DIOD-SOT323-3_V]
Q3  BC817-40W  [DIOD-SOT323-3_V]
R11  10 K  [FP-COM-09806-MFG]
R12  1K  [FP-RN73R2A-IPC_A]
R13  10 K  [FP-RN73R2A-IPC_A]
R14  10 K  [FP-RN73R2A-IPC_A]
R15  330  [FP-RN73R2A-IPC_A]
R16  330  [FP-RN73R2A-IPC_A]
R17  330  [FP-RN73R2A-IPC_A]
R18  1K  [FP-RN73R2A-IPC_A]
R19  330  [FP-RN73R2A-IPC_A]
SW2  1-1825910-4  [FP-1-1825910-4-MFG]  (value not drawn)
SW3  1-1825910-4  [FP-1-1825910-4-MFG]  (value not drawn)
U4  LM35DZ/NOPB  [LP0003A]

### Blocks framed on the sheet
LM35-TEMPERATURA: C10-C12 J17 U4
BUZZER: LS1 Q2 R12
POTENCIOMETRO ANALOGICO: C13 R11
LEDS: D2-D4 R15-R17
PULSADORES: R13 R14 SW2 SW3
RELE DE SALIDA: D1 D5 J18 K1 Q3 R18 R19
DISPLAY OLED: J19

### Ports
BUZZER (in), CS (in), DC (in), LED1 (out), LED2 (out), LED3 (out), LM35 (out), MOSI (in), POTE_ANALOG (out), PULSADOR1 (out), PULSADOR2 (out), RELE (in), RST (in), SCK (in)

### Nets
+3.3V: R11.1(CW) R13.2 R14.2 R15.2 R16.2 R17.2
+5V: C12.2 J17.1 J19.2 LS1.1(C) U4.1(+VS)
+12V: D1.1(C) K1.2
AGND: C10.1 C11.1 C12.1 C13.1 J17.3 R11.3(CCW) U4.3(GND)
DGND: D5.1(C) J19.1 Q2.2(E) Q3.2(E) SW2.1 SW3.1
COMUN: J18.2 K1.1
MOSI: J19.4 ; port MOSI
NA: J18.1 K1.3
NC: J18.3 K1.4
PTB0: C10.2 C11.2 J17.2 U4.2(VO) ; port LM35
PTB1: C13.2 R11.2(WIPER) ; port POTE_ANALOG
PTB2: J19.6 ; port DC
PTB3: J19.5 ; port RST
PTB16: R13.1 SW3.4 ; port PULSADOR2
PTB17: R14.1 SW2.4 ; port PULSADOR1
PTC5: J19.3 ; port SCK
PTD2: J19.7 ; port CS
PTE0: R18.2 R19.2 ; port RELE
PTE20: D2.1(C) ; port LED1
PTE21: D3.1(C) ; port LED2
PTE22: D4.1(C) ; port LED3
PTE30: R12.2 ; port BUZZER
NetD1_2: D1.2(A) K1.5 Q3.3(C)
NetD2_2: D2.2(A) R15.1
NetD3_2: D3.2(A) R16.1
NetD4_2: D4.2(A) R17.1
NetD5_2: D5.2(A) R19.1
NetLS1_2: LS1.2(A) Q2.3(C)
NetQ2_1: Q2.1(B) R12.1
NetQ3_1: Q3.1(B) R18.1

Not connected (* = marked no-connect by the designer): SW2 2 3; SW3 2 3

### Layout directives
rule Clearance Constraint [Clearance = 2.5mm]: COMUN, NA, NC

### Library data of the parts
C10-C13 = CMP-2007-01227-1: as C3 on sheet RS485
D1 = CMP-12389-000001-1: DIODE 1N4148 RELE PROTECTION
D2-D4 = CMP-00229-00139794-1: LED SMD 0805; NexarPartId: 139794; Approvals: CSA, UL; Lens Color: Clear, Yellow; Luminous Intensity: 150mcd; Power Rating: 120mW; Forward Current: 20mA; Forward Voltage: 3.5V; Illumination Color: White; Number of LEDs: 1; Viewing Angle: 120°; RoHS: Compliant; Case/Package: 0805; Min Operating Temperature: -40°C; Mount: Surface Mount; Max Operating Temperature: 85°C
D5 = CMP-00229-00139794-1: LED SMD 0805 / Rele status; NexarPartId: 139794; Approvals: CSA, UL; Lens Color: Clear, Yellow; Luminous Intensity: 150mcd; Power Rating: 120mW; Forward Current: 20mA; Forward Voltage: 3.5V; Illumination Color: White; Number of LEDs: 1; Viewing Angle: 120°; RoHS: Compliant; Case/Package: 0805; Min Operating Temperature: -40°C; Mount: Surface Mount; Max Operating Temperature: 85°C
J17 = CMP-02766-001396-1: HEADER PINS 3 POS / LM35 Pins; Pitch: 2.54mm; Connector Type: Receptacle; Max Current Rating: 7.6A; Max Voltage Rating (AC): 550V; Gender: Female; Number of Positions: 3; Contact Resistance: 10mR; Length: 8.13mm; Color: Black; Packaging: Bulk; Height: 8.51mm; RoHS Compliant: Yes; Min Operating Temperature: -55°C; Contact Type: Female Socket; Number of Rows: 1; Series: SSQ; Housing Color: Black; Lead Free: Lead Free; Mount: Through Hole; Housing Material: Plastic; Contact Material: Bronze; Contact Plating: Tin; Orientation: Straight; Termination: Solder; Max Operating Temperature: 105°C; Width: 2.41mm; Radiation Hardening: No; Number of Contacts: 3
J18 = CMP-1502-02533-3: TERMINAL BLOCK 3 POS / Salida Rele; Number of Contacts: 3; Voltage Rating: 300V; Current Rating: 24A; RoHS: Compliant; Height: 13.9mm; Contact Material: Nickel, Tin; Max Operating Temperature: 120°C; Number of Rows: 1; Min Operating Temperature: -30°C
J19 = CMP-1502-01326-4: HEADER PINS 7 POS / Pins Display OLED; Gender: Female; Operating Supply Voltage: 250V; Current Rating: 3A; Contact Resistance: 20mΩ; Lead Pitch: 2.54mm; RoHS: Non-Compliant; Orientation: Vertical; Number of Pins: 7
K1 = CMP-08822-000286-1: RELAY; Power Consumption: 400mW; Throw Configuration: SPDT; Coil Resistance: 63R; Coil Type: Non-Latching; Release Time: 5ms; Max Voltage Rating (AC): 250V; Relay Type: General Purpose; Coil Voltage (DC): 5V; Max Current Rating: 16A; Life (Hours): 1000000Hour; Coil Current: 79.4mA; Operate Time: 10ms; Packaging: Rail/Tube; Lead Free: Lead Free; Termination: Solder; Height: 19mm; Series: G5LE; RoHS Compliant: Yes; Min Operating Temperature: -25°C; Package Quantity: 100; Width: 16.5mm; Contact Material: Tin; Length: 22.5mm; Coil Power: 400mW; Depth: 16.5mm; Radiation Hardening: No; Contact Current Rating: 16A; Weight: 12g; Max Operating Temperature: 85°C; Number of Pins: 5; Mount: PCB
LS1 = CMP-231722-000001-1: BUZZER MAGNETIC 5V 12MM TH; Operating Supply Current: 40mA; Frequency: 2.4kHz; Min Operating Temperature: -30°C; Voltage Rating: 5V; Mount: Through Hole; Diameter: 12mm; Termination: PC Pins; Max Operating Temperature: 70°C; Contact Plating: Tin; Height: 9mm; Series: AT; Max Supply Current: 40mA; Sensing Method: Magnetic; Packaging: Tray
Q2 = CMP-2000-05934-1: BJT NPN BC817 / Buzzer; Manufacturer: DiodesIncorporated; Configuration: Single; Collector- Emitter Voltage VCEO Max: 45V; Emitter- Base Voltage VEBO: 5V; DC Collector/Base Gain hfe Min: 250; Collector-Emitter Saturation Voltage: 0.7V; Collector- Base Voltage VCBO: 50V; Maximum DC Collector Current: 1A; Pd - Power Dissipation: 200mW; Gain Bandwidth Product fT: 100MHz; Unit Weight: 0.000282oz; Series: BC817; Datasheet Version: Rev. 5-2, 01/2014; Datasheet URL: http://www.diodes.com/_files/datasheets/ds30575.pdf; Manufacturer URL: http://www.diodes.com/; Length: 2.2mm; Mounting Style: SMD/SMT; Maximum Operating Temperature: +150C; Package Description: 3-Pin Small Outline Transistor, Body 2 x 1.25 mm, Pitch 0.65 mm; Width: 1.35mm; RoHS: True; Minimum Operating Temperature: -65C; Brand: DiodesIncorporated; Product Category: BipolarTransistors-BJT; Height: 1mm; Factory Pack Quantity: 3000; Package / Case: SOT-23; Packaging: Reel; Transistor Polarity: NPN; Mounting Technology: SurfaceMount; Package Reference: SOT323
Q3 = CMP-2000-05934-1: BJT NPN BC817 SOT323 / Rele; Manufacturer: DiodesIncorporated; Configuration: Single; Collector- Emitter Voltage VCEO Max: 45V; Emitter- Base Voltage VEBO: 5V; DC Collector/Base Gain hfe Min: 250; Collector-Emitter Saturation Voltage: 0.7V; Collector- Base Voltage VCBO: 50V; Maximum DC Collector Current: 1A; Pd - Power Dissipation: 200mW; Gain Bandwidth Product fT: 100MHz; Unit Weight: 0.000282oz; Series: BC817; Datasheet Version: Rev. 5-2, 01/2014; Datasheet URL: http://www.diodes.com/_files/datasheets/ds30575.pdf; Manufacturer URL: http://www.diodes.com/; Length: 2.2mm; Mounting Style: SMD/SMT; Maximum Operating Temperature: +150C; Package Description: 3-Pin Small Outline Transistor, Body 2 x 1.25 mm, Pitch 0.65 mm; Width: 1.35mm; RoHS: True; Minimum Operating Temperature: -65C; Brand: DiodesIncorporated; Product Category: BipolarTransistors-BJT; Height: 1mm; Factory Pack Quantity: 3000; Package / Case: SOT-23; Packaging: Reel; Transistor Polarity: NPN; Mounting Technology: SurfaceMount; Package Reference: SOT323
R11 = CMP-02417-76381460-1: RES TRIMMER 10K 5% THT; Temperature Coefficient: 100ppm/°C; Tolerance: 10%; Power Rating: 500mW; Resistance: 10kΩ; Max Operating Temperature: 125°C; Composition: Cermet; Height: 10.92mm; Min Operating Temperature: -55°C; NexarPartId: 76381460
R12 = CMP-04015-052084-1: RES 1K 5% 0805 / Buzzer
R13 R14 = CMP-04015-052084-1: RES 10K 5% 0805
R15-R17 = CMP-04015-052084-1: RES 330R 5% 0805
R18 = CMP-04015-052084-1: RES 1K 5% 0805 / Rele
R19 = CMP-04015-052084-1: RES 330R 5% 0805 / Rele
SW2 = CMP-03407-000002-1: SWITCH TACTILE 6mm / Pulsador 1; Manufacturer: TE Connectivity; Throw Configuration: SPST-NO; Operating Force: 160gf; Contact Current Rating: 50mA; Voltage Rating Dc: 24V; Electromechanical Life: 100000Cycles; Contact Resistance: 100mΩ; Octopart: https://octopart.com/1-1825910-4-te+connectivity-42270468; ComponentLink2URL: https://www.te.com/commerce/DocumentDelivery/DDEController?Action=showdoc&DocId=Customer+Drawing%7F1825910%7FC10%7Fpdf%7FEnglish%7FENG_CD_1825910_C10.pdf%7F1-1825910-4; Height: 9.8mm; Package: 1-1825910-4; Automotive: No; Device Class L2: Switches; Temperature Range High: +85°C; Device Class L3: Tactile Switches; Mouser Description: Tactile Switches 6MM ACTHIGH TEMP TACT SWITCH; Manufacturer Part Number: 1-1825910-4; Lead Free: Yes; Temperature Range Low: -35°C; Digikey Description: SWITCH TACTILE SPST-NO 0.05A 24V; Device Class L1: Electromechanical; Mount: Through Hole; RoHS: TRUE; ComponentLink2Description: Datasheet; Temperature: -35°C to +85°C; Category: Switch
SW3 = CMP-03407-000002-1: SWITCH TACTILE 6mm / Pulsador 2; Manufacturer: TE Connectivity; Throw Configuration: SPST-NO; Operating Force: 160gf; Contact Current Rating: 50mA; Voltage Rating Dc: 24V; Electromechanical Life: 100000Cycles; Contact Resistance: 100mΩ; Octopart: https://octopart.com/1-1825910-4-te+connectivity-42270468; ComponentLink2URL: https://www.te.com/commerce/DocumentDelivery/DDEController?Action=showdoc&DocId=Customer+Drawing%7F1825910%7FC10%7Fpdf%7FEnglish%7FENG_CD_1825910_C10.pdf%7F1-1825910-4; Height: 9.8mm; Package: 1-1825910-4; Automotive: No; Device Class L2: Switches; Temperature Range High: +85°C; Device Class L3: Tactile Switches; Mouser Description: Tactile Switches 6MM ACTHIGH TEMP TACT SWITCH; Manufacturer Part Number: 1-1825910-4; Lead Free: Yes; Temperature Range Low: -35°C; Digikey Description: SWITCH TACTILE SPST-NO 0.05A 24V; Device Class L1: Electromechanical; Mount: Through Hole; RoHS: TRUE; ComponentLink2Description: Datasheet; Temperature: -35°C to +85°C; Category: Switch
U4 = CMP-0066-00030-3: CI LM35 TO92; Manufacturer: Texas Instruments; PowerWise: N; PackageTopMarking: NSXYTT*LM35*DZ; CompType: Temp Sensor IC; RoHS: Y; PackageReference: LP0003A; PinCount: 3; ComponentLink1URL: http://www.ti.com/general/docs/lit/getliterature.tsp?genericPartNumber=LM35&fileType=pdf; Code_JEDEC: TO-226-AA; PackageDescription: TO-92, Molded, 3 Lead; ComponentLink1Description: Datasheet URL

## Sheet RTC.SchDoc: RTC y EEPROM
size A4; Author: Agustin Zuliani; Revision: 00; SheetNumber: 7; SheetTotal: 7
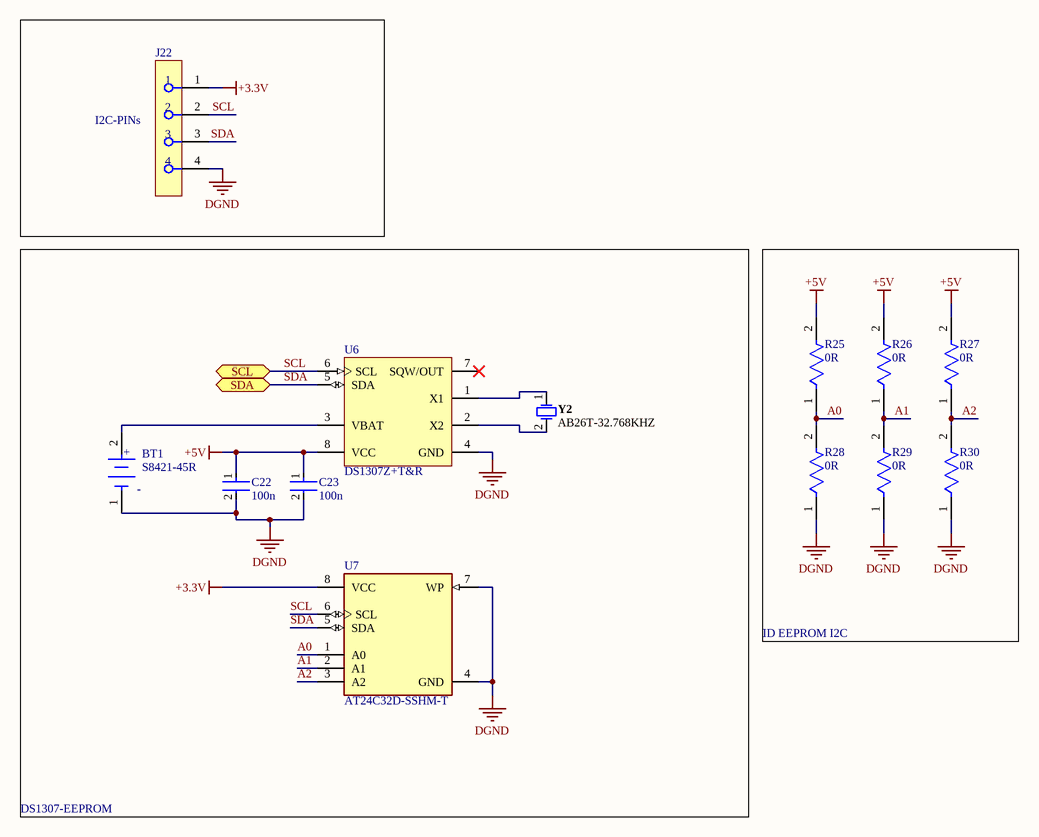
[diagram p5: RTC.SchDoc]

### Parts
BT1  S8421-45R  [FP-S8421-45R-MFG]
C22  100n  [FP-C0805C-DN-MFG]
C23  100n  [FP-C0805C-DN-MFG]
J22  I2C-PINs  [FP-ESW-104-23-G-S-MFG]
R25  0R  [FP-TLRZ1E-MFG]
R26  0R  [FP-TLRZ1E-MFG]
R27  0R  [FP-TLRZ1E-MFG]
R28  0R  [FP-TLRZ1E-MFG]
R29  0R  [FP-TLRZ1E-MFG]
R30  0R  [FP-TLRZ1E-MFG]
U6  DS1307Z+T&R  [S8+2_L]
U7  AT24C32D-SSHM-T  [FP-C04-057-SN-IPC_C]
Y2  AB26T-32.768KHZ  [ABRA-AB26T]

### Blocks framed on the sheet
DS1307-EEPROM: BT1 C22 C23 U6 U7 Y2
ID EEPROM I2C: R25-R30

### Ports
SCL (bidir), SDA (bidir)

### Nets
+3.3V: J22.1 U7.8(VCC)
+5V: C22.1 C23.1 R25.2 R26.2 R27.2 U6.8(VCC)
DGND: BT1.1(C) C22.2 C23.2 J22.4 R28.1 R29.1 R30.1 U6.4(GND) U7.4(GND) U7.7(WP)
A0: R25.1 R28.2 U7.1(A0)
A1: R26.1 R29.2 U7.2(A1)
A2: R27.1 R30.2 U7.3(A2)
SCL: J22.2 U6.6(SCL) U7.6(SCL) ; port SCL  [project net PTC1]
SDA: J22.3 U6.5(SDA) U7.5(SDA) ; port SDA  [project net PTC2]
NetBT1_2: BT1.2(A) U6.3(VBAT)
NetU6_1: U6.1(X1) Y2.1
NetU6_2: U6.2(X2) Y2.2

Not connected (* = marked no-connect by the designer): U6 7(SQW/OUT)*

### Notes on the sheet
- (in symbol CMP-2000-07028-3) +; -

### Library data of the parts
BT1 = CMP-2000-07028-3: BATTERY HOLDER COIN 20MM SMD; Number of Cells: 1; Min Operating Temperature: -40°C; Packaging: Tape and Reel; Max Operating Temperature: 105°C; Number of Batteries: 1; Package Quantity: 500; Material: Polyphenylene; Case/Package: SMD/SMT; Mount: Surface Mount; REACH SVHC: No SVHC; Contact Plating: Bronze; Termination: SMD/SMT
C22 C23 = CMP-2007-00520-2: CAP 100nf 20% 0805; Manufacturer: KEMET; Manufacturer Part Number: C0805C101J1GAC7210; Value: 100 pF; Temperature Characteristic: C0G; Material: Ceramic; Tolerance: 0.05; Voltage Rating: 100 V; Temperature Coefficient: 30ppm/°C; Package: C0805C-DN; Device Class L1: Passive Components; Octopart: https://octopart.com/c0805c101j1gac7210-kemet-9145156; RoHS: TRUE; Capacitance: 100 pF; Ipc Land Pattern Name: CAPC200125X78; Temperature Range Low: -55°C; Temperature Range High: +125°C; ComponentLink2Description: Datasheet; Lead Free: Yes; Temperature: -55°C to +125°C; ComponentLink2URL: https://content.kemet.com/datasheets/KEM_C1003_C0G_SMD.pdf; Category: Cap; Device Class L2: Capacitors; Mouser Description: Multilayer Ceramic Capacitors MLCC - SMD/SMT 100volts 100pF C0G 5%; Height: 0.88mm; Automotive: No; Device Class L3: Ceramic Capacitors
J22 = CMP-00575-09268283-1: HEADER PINS 4 POS / I2C Pins; Manufacturer Lifecycle Status: PRODUCTION; Contact Resistance: 10mΩ; Max Voltage Rating (AC): 550V; Current Rating: 5.2A; Max Current Rating: 6.9A; Number of Contacts: 4; Pitch: 2.54mm; Length: 10.67mm; Termination: Solder; Contact Material: Gold, Nickel; Orientation: Straight; Housing Material: Polyester; Max Operating Temperature: 125°C; Depth: 2.41mm; RoHS: Compliant; Housing Color: Black; Min Operating Temperature: -55°C; Number of Rows: 1; Height: 13.72mm; Radiation Hardening: No; Lifecycle Status: Production; Contact Plating: Gold
R25-R30 = CMP-00683-81738753-1: RES 0R 5% 0805; Resistance: 0Ω; NexarPartId: 81738753; Min Operating Temperature: -65°C; Height: 405µm; Max Operating Temperature: 170°C; Composition: Metal Element; Case/Package: 0402; Lifecycle Status: Production
U6 = CMP-0254-00305-1: CI DS1307; Code_JEDEC: MS-012-AA; Code_IPC: SOIC127P600-8; ComponentLink2Description: Datasheet; DatasheetVersion: 10-Feb-2008; ComponentLink2URL: http://datasheets.maxim-ic.com/en/ds/DS1307.pdf; PackageVersion: revC, 2010; ComponentLink1Description: Manufacturer URL; PackageDescription: 8-Pin Small-Outline IC, Narrow (0.15in), 1.27 mm Pitch, SOIC (N), Pb-Free; ComponentLink1URL: http://www.maxim-ic.com; ComponentLink3URL: http://pdfserv.maxim-ic.com/package_dwgs/21-0041.PDF; PackageReference: S8+2; ComponentLink3Description: Package Specification
U7 = CMP-06313-000048-1: CI EEPROM 32K I2C 1MHZ 8SOIC; Memory Type: Non-Volatile; Memory Size: 32Kb; Access Time: 550ns; Frequency: 1MHz; Max Operating Temperature: 85°C; Number of Pins: 8; Packaging: Tape and Reel; Min Operating Temperature: -40°C; Case/Package: SOIC; Mount: Surface Mount
Y2 = CMP-2000-05723-1: CRYSTAL 32.768KHz RTC; Manufacturer: ABRACON; ESR: 35kOhms; Frequency Stability: -0.034PPM; Load Capacitance: 12.5pF; Tolerance: 20PPM; Case Length: 6.2mm; Case Diameter: 2.1mm; RoHS: Details; Product Category: Crystals; Type: WatchCrystal; Manufacturer URL: http://www.abracon.com/; Operating Temperature Range: -10Cto+60C; Package Description: 2-Pin Through Hole Device, Dia 2.1 mm, Body Length 6.2 mm; Termination Style: Radial; Datasheet Version: 06/2010; Datasheet URL: http://www.abracon.com/Resonators/AB26T.pdf; Packaging: Bulk; Factory Pack Quantity: 500; Brand: ABRACON; Mounting Technology: ThroughHole; Package URL: http://www.abracon.com/Support/PackageDrawing/Resonators/AB26T.PDF; Package / Case: Cylinder; Lead Spacing: 0.8mm; Dimensions: 2.1mmDia.x6.2mmL; Mounting Style: ThroughHole; Frequency: 32.768kHz; Package Reference: AB26T; Series: AB26T

## Nets that join several sheets
+3.3V: main (J3.8 J5.3), RS485 (8 pins), Perifericos (6 pins), RTC (J22.1 U7.8)
+5V: main (J3.10 J5.2), RS485 (6 pins), CANBUS (6 pins), Perifericos (5 pins), RTC (6 pins)
+12V: main (J5.1), Potencia (F1.1), Perifericos (D1.1 K1.2)
DGND: main (6 pins), RS485 (7 pins), CANBUS (9 pins), Potencia (D7.2 Q4.3 R22.2), Perifericos (6 pins), RTC (10 pins)
~{CAN_CS}: main (J1.7 TP5.1), CANBUS (U2.16)
~{INT}: main (J2.2), CANBUS (U2.12)
~{RE}: main (J1.8), RS485 (R3.1 R4.1 U1.2 U1.3)
MISO: main (J1.11 TP2.1), CANBUS (J16.2 U2.15)
MOSI: main (J1.9 TP1.1), CANBUS (J16.1 U2.14), Perifericos (J19.4)
PTB0: main (J4.2), Perifericos (C10.2 C11.2 J17.2 U4.2)
PTB1: main (J4.4), Perifericos (C13.2 R11.2)
PTB2: main (J4.6), Perifericos (J19.6)
PTB3: main (J4.8), Perifericos (J19.5)
PTB16: main (J2.19), Perifericos (R13.1 SW3.4)
PTB17: main (J2.17), Perifericos (R14.1 SW2.4)
PTC1: main (J4.12 TP6.1), RTC (J22.2 U6.6 U7.6)
PTC2: main (J4.10 TP4.1), RTC (J22.3 U6.5 U7.5)
PTC5: main (J1.15 TP3.1), CANBUS (J16.3 U2.13), Perifericos (J19.3)
PTD2: main (J2.4), Perifericos (J19.7)
PTD4: main (J2.6), RS485 (J12.4 J13.1)
PTD5: main (J2.12), RS485 (J10.1 J12.3)
PTE0: main (J2.18 J4.9), Perifericos (R18.2 R19.2)
PTE20: main (J4.1), Perifericos (D2.1)
PTE21: main (J4.3), Perifericos (D3.1)
PTE22: main (J4.5), Perifericos (D4.1)
PTE29: main (J1.14), Potencia (R20.2 R21.1 TP9.1)
PTE30: main (J1.16 J4.11), Perifericos (R12.2)